# EAGLE design LEDBatterychargeIndicatorCircuit (EAGLE 9.4.2)
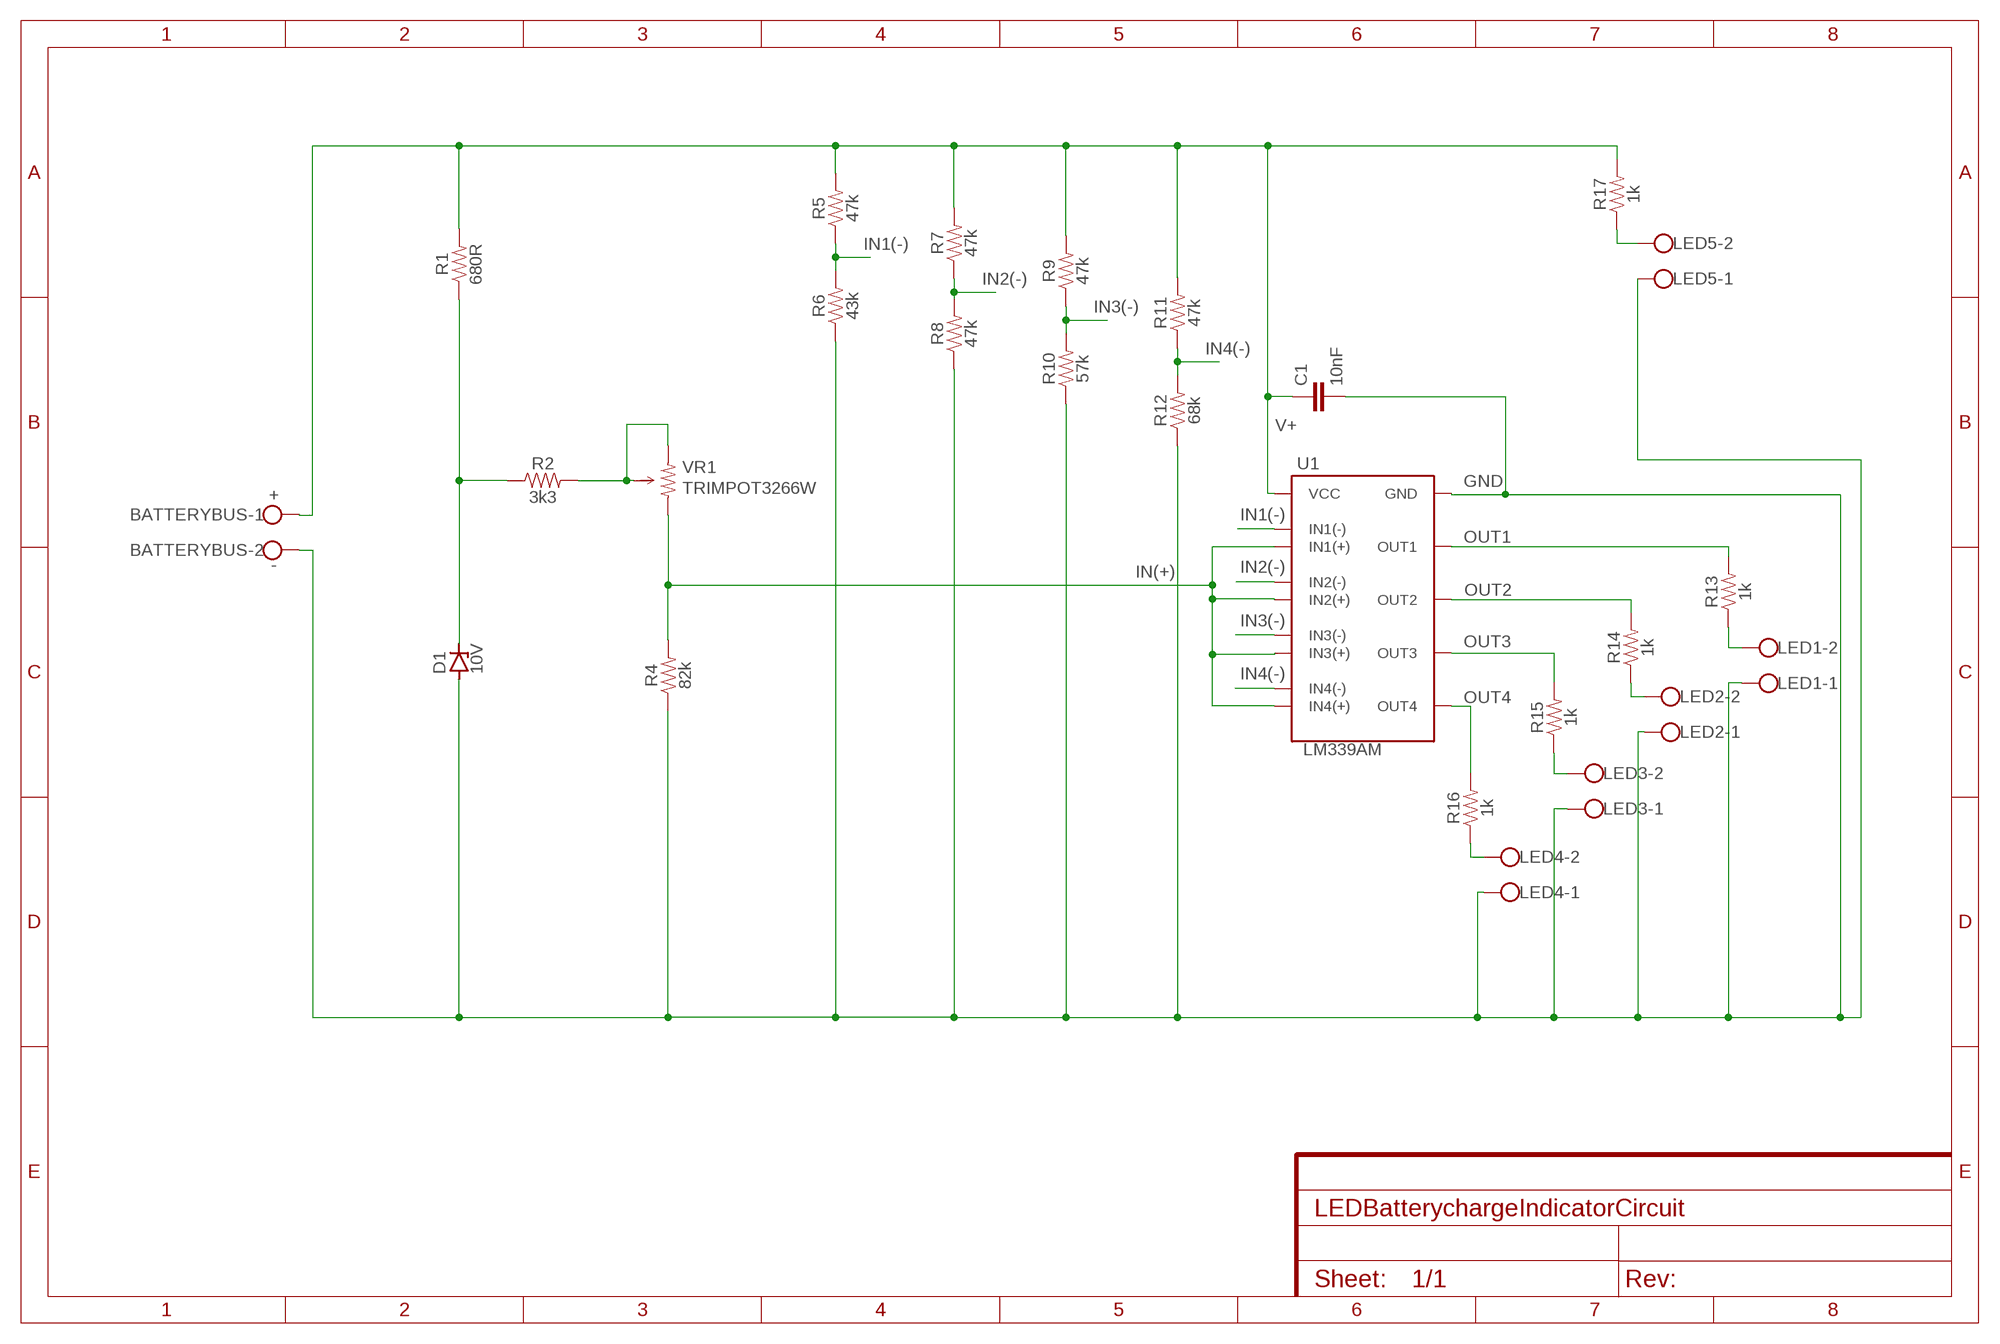
[diagram p0: schematic, sheet 1]

## Parts
BATTERYBUS  W237-102  [W237-102]
C1  10nF  C7.5/5  [C7.5B5]
D1  10V  ZENER-DIODEF126-12  [F126Z12]
LED1  W237-102  [W237-102]
LED2  W237-102  [W237-102]
LED3  W237-102  [W237-102]
LED4  W237-102  [W237-102]
LED5  W237-102  [W237-102]
R1  680R  RESISTOR0805  [0805]
R2  3k3  RESISTOR0805  [0805]
R4  82k  RESISTOR0805  [0805]
R5  47k  RESISTOR0805  [0805]
R6  43k  RESISTOR0805  [0805]
R7  47k  RESISTOR0805  [0805]
R8  47k  RESISTOR0805  [0805]
R9  47k  RESISTOR0805  [0805]
R10  57k  RESISTOR0805  [0805]
R11  47k  RESISTOR0805  [0805]
R12  68k  RESISTOR0805  [0805]
R13  1k  RESISTOR0805  [0805]
R14  1k  RESISTOR0805  [0805]
R15  1k  RESISTOR0805  [0805]
R16  1k  RESISTOR0805  [0805]
R17  1k  RESISTOR0805  [0805]
U1  LM339AM  LM339AMSMD  [LM339AM]
VR1  TRIMPOT3266W  [TRIMPOT3266W]

## Nets
GND: BATTERYBUS.2 C1.2 D1.A LED1.1 LED2.1 LED3.1 LED4.1 LED5.1 R4.1 R6.1 R8.1 R10.1 R12.1 U1.12(GND)
IN1(-): R5.1 R6.2 U1.4(IN1(-))
IN2(-): R7.1 R8.2 U1.6(IN2(-))
IN3(-): R9.1 R10.2 U1.8(IN3(-))
IN4(-): R11.1 R12.2 U1.10(IN4(-))
IN(+): R4.2 U1.5(IN1(+)) U1.7(IN2(+)) U1.9(IN3(+)) U1.11(IN4(+)) VR1.1
N$4: D1.C R1.1 R2.1
N$6: R2.2 VR1.2(WIPER) VR1.3
N$8: LED1.2 R13.1
N$10: LED2.2 R14.1
N$13: LED3.2 R15.1
N$15: LED4.2 R16.1
N$16: LED5.2 R17.1
OUT1: R13.2 U1.2(OUT1)
OUT2: R14.2 U1.1(OUT2)
OUT3: R15.2 U1.14(OUT3)
OUT4: R16.2 U1.13(OUT4)
V+: BATTERYBUS.1 C1.1 R1.2 R5.2 R7.2 R9.2 R11.2 R17.2 U1.3(VCC)

## Notes on the sheet
- +
- -

## Library data of the parts
BATTERYBUS LED1-LED5 = con-wago-500:W237-102: WAGO SCREW CLAMP; MPN: 237-102; OC_FARNELL: unknown; OC_NEWARK: 70K9898
C1 = capacitor-wima:C: CAPACITOR naming: grid - package width
D1 = diode:ZENER-DIODE: Z-Diode
R1 R2 R4-R17 = SparkFun-Resistors:RESISTOR: Generic Resistor Package
U1 = RequiredComponents:LM339AM: The LM339AM is a quad comparator that requires 32V supply (+-18V) with a typical response time of 1.3us
VR1 = RequiredComponents:TRIMPOT3266W

## Board
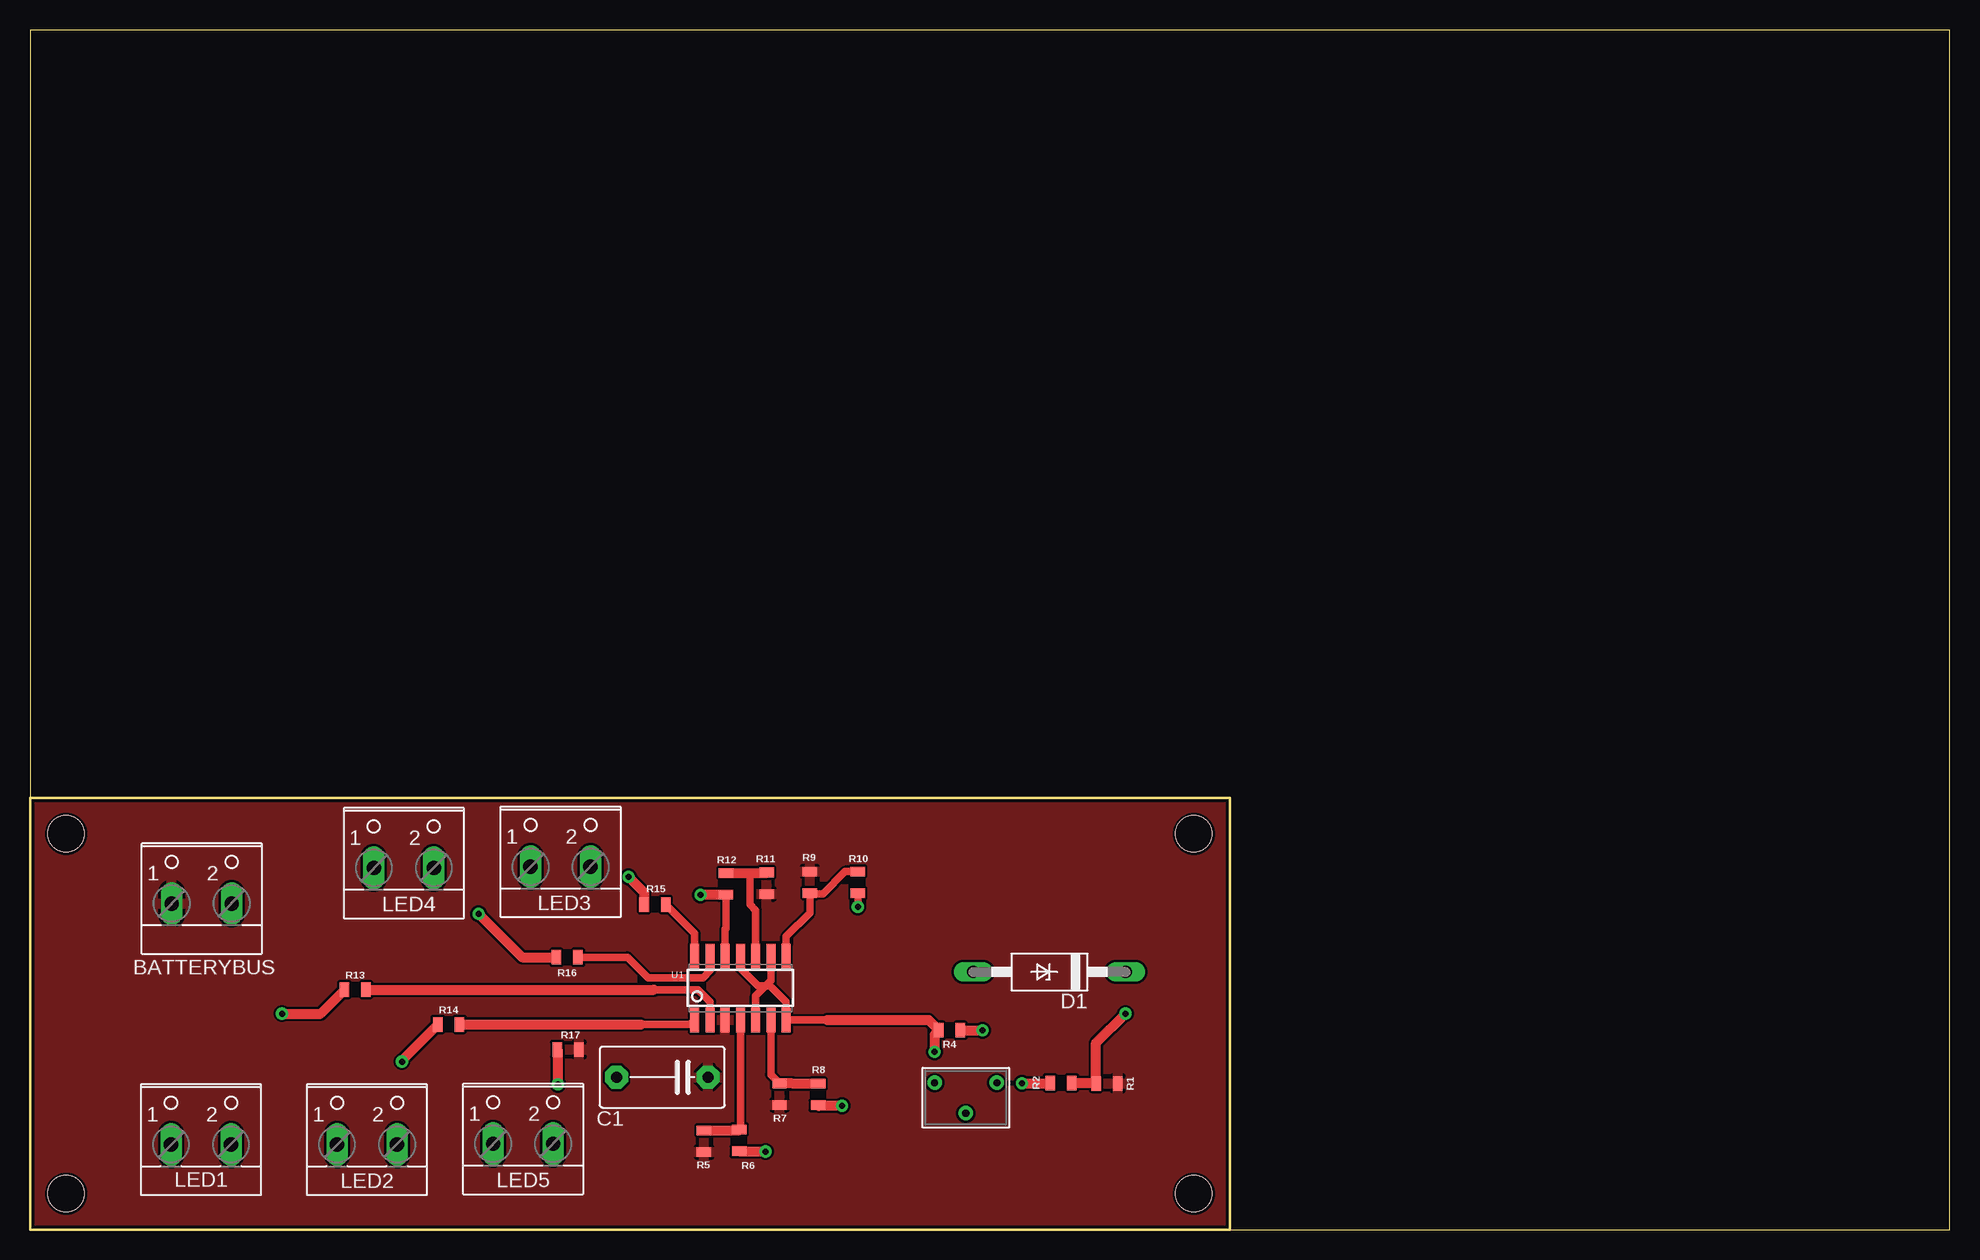
[diagram p1: board, top side]
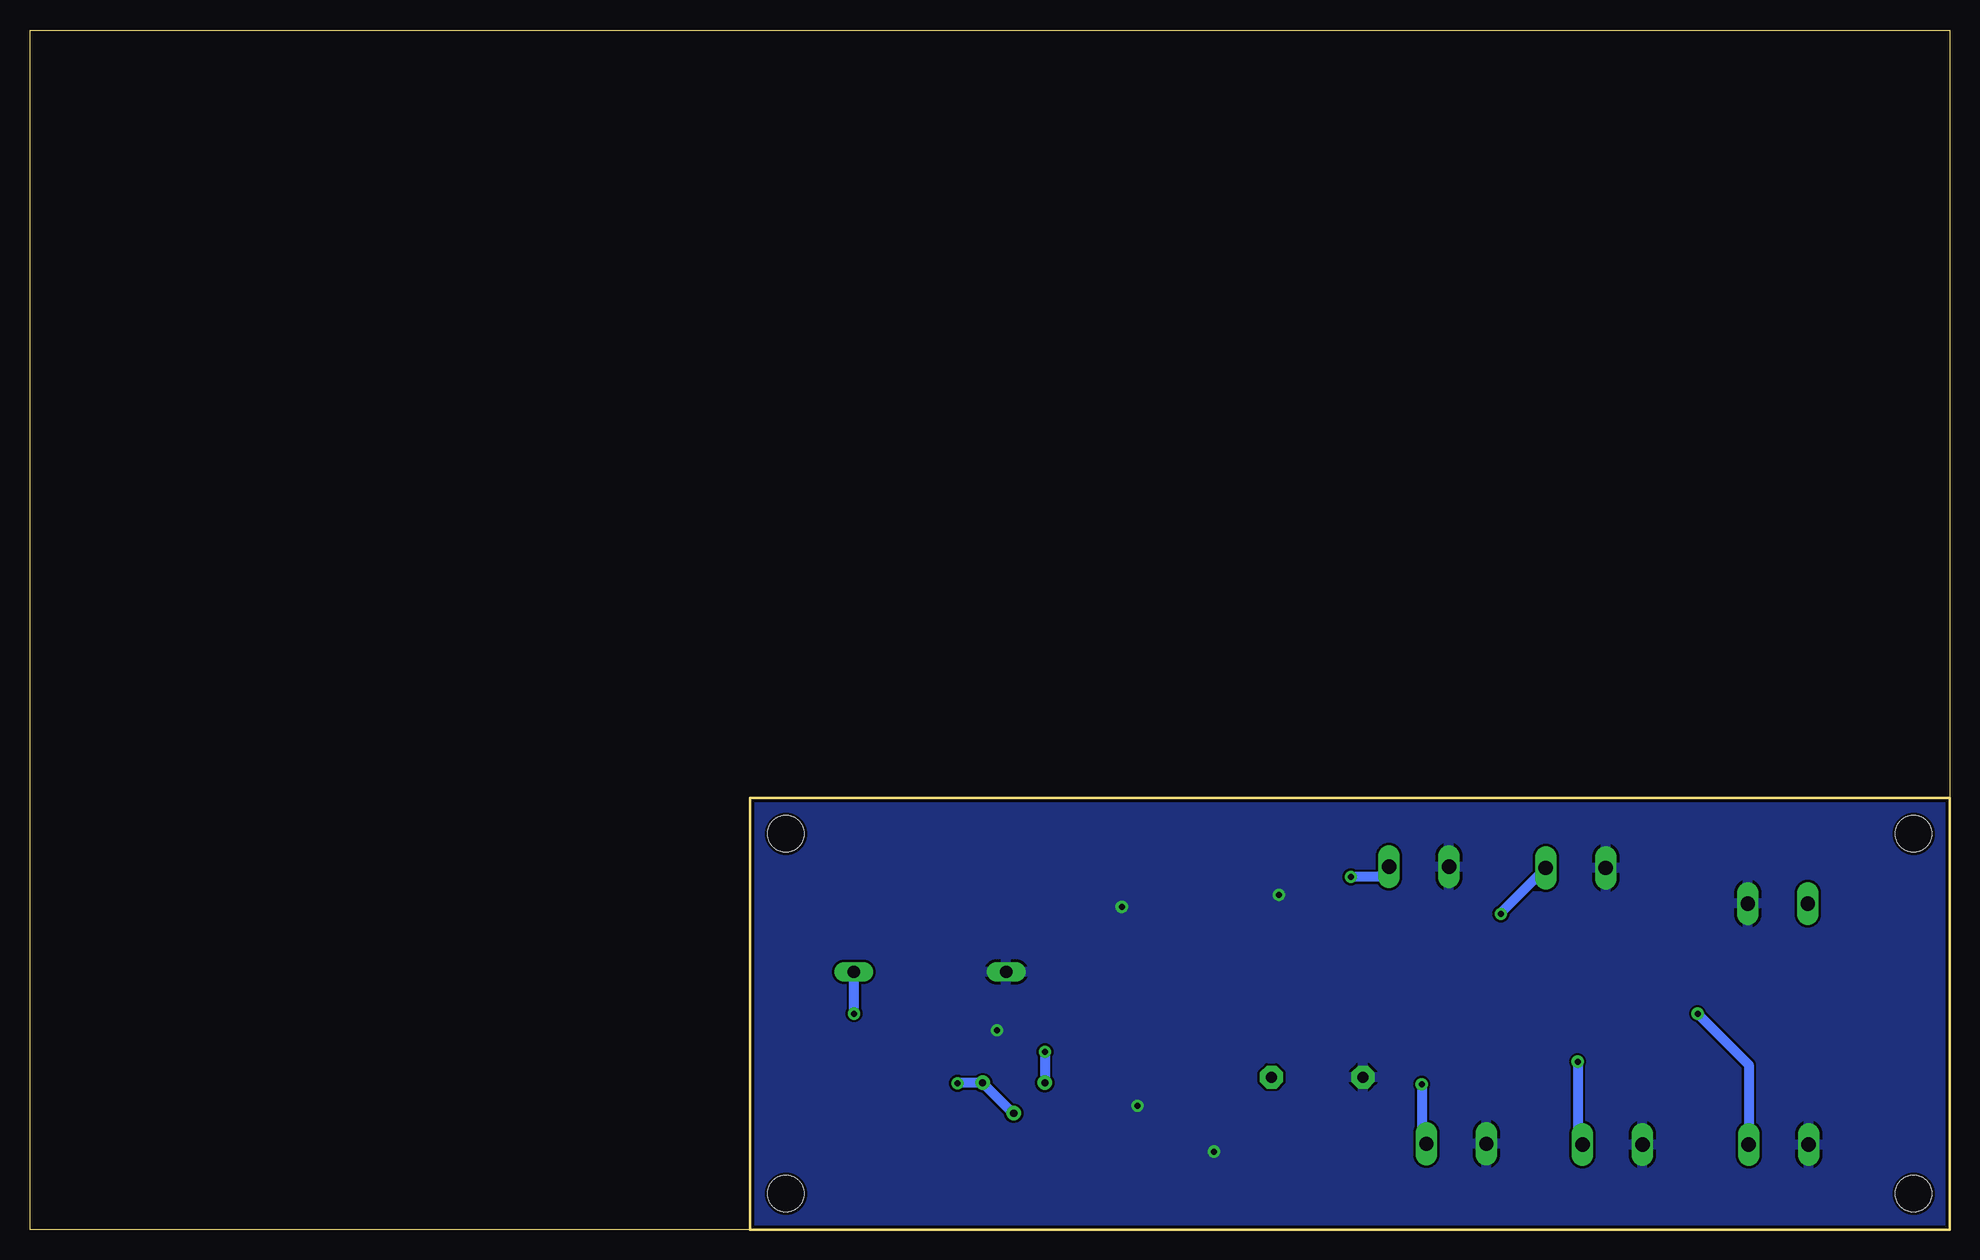
[diagram p2: board, bottom side, seen from below]

Size 160 x 100 mm. Coordinates in mm from the lower left corner, seen from the top.
Outline: 100,0 160,0 160,100 0,100 0,36
Outline: 0,36 0,0 100,0
Outline: 0,36 100,36 100,0
Copper layers (1*16): Top 0.035mm / dielectric 1.5mm / Bottom 0.035mm
Design rules "PCBTrain": minimum track width 8mil, minimum drill 0.2mm, track to track 8mil, track to pad 8mil, pad to pad 8mil, via to via 8mil, smd to smd 8mil, copper to edge 0.25mm, drill to drill 8mil, minimum pad ring 12mil, minimum via ring 10mil, stop-mask expansion 4mil, vias tented up to drill 20mil, thermal gap 10mil
Holes 3 mm at 3,33 3,3 97,3 97,33

### Footprints (pad centres in the part's own frame; a part is rotated, then mirrored left to right if it is on the bottom)
W237-102 = drill 1.194 long: 1 -2.5,-1.27; 2 2.5,-1.27
C7.5B5 = drill 0.914 pad 1.905 octagon: 1 -3.81,0; 2 3.81,0
F126Z12 = drill 1.016 long: A 6.35,0; C -6.35,0
0805 = smd 0.8 x 1.2: 1 -0.9,0; 2 0.9,0
LM339AM = smd 0.75 x 2.04: 1 -3.81,-2.66; 2 -2.54,-2.66; 3 -1.27,-2.66; 4 0,-2.66; 5 1.27,-2.66; 6 2.54,-2.66; 7 3.81,-2.66; 8 3.81,2.66; 9 2.54,2.66; 10 1.27,2.66; 11 0,2.66; 12 -1.27,2.66; 13 -2.54,2.66; 14 -3.81,2.66
TRIMPOT3266W = drill 0.6: 1 -2.595,1.23; 2 0,-1.31; 3 2.595,1.23

### Placement (x,y rotation side)
BATTERYBUS  14.31,28.45 0 top
C1  52.7,12.7 180 top
D1  84.98,21.47 180 top
LED1  14.25,8.35 0 top
LED2  28.09,8.35 0 top
LED3  44.22,31.51 0 top
LED4  31.16,31.41 0 top
LED5  41.1,8.41 0 top
R1  89.77,12.18 0 top
R2  85.94,12.22 180 top
R4  76.65,16.62 180 top
R5  56.18,7.36 270 top
R6  59.12,7.43 90 top
R7  62.48,11.28 270 top
R8  65.7,11.26 90 top
R9  65,28.95 90 top
R10  69,28.94 90 top
R11  61.4,28.87 270 top
R12  58,28.82 90 top
R13  27.11,20 0 top
R14  34.9,17.1 0 top
R15  52.09,27.1 0 top
R16  44.78,22.7 0 top
R17  44.86,15.01 0 top
U1  59.22,20.13 0 top
VR1  78,11 0 top

### Tracks (layer width: path | path; a pad name or v marks a point on that pad's centre or on a via)
GND  (via drill 0.5)
  Top 0.61: U1.12 57.95,25.05 58,25.1 R12.1 | R10.1 v69,26.9
  Top 0.813: v67.7,10.3 65.76,10.3 R8.1 | v61.3,6.5 61.27,6.53 R6.1 | v55.9,27.9 55.92,27.92 R12.1 | R4.1 79.38,16.62 v79.4,16.6
  pour Bottom: 0,36 100,36 100,0 0,0
IN1(-)
  Top 0.61: R6.2 59.22,8.43 U1.4
  Top 0.813: R5.1 59.05,8.26 R6.2
IN2(-)
  Top 0.61: U1.6 61.76,12.9 R7.1
  Top 0.813: R8.2 63.6,12.16 63.58,12.18 R7.1
IN3(-)
  Top 0.61: U1.8 63.03,24.43 65,26.4 R9.1 65.05,28 66.1,28 67.94,29.84 R10.2
IN4(-)
  Top 0.61: U1.10 60.49,26.61 60,27.1 60,29.72
  Top 0.813: R11.1 61.35,29.72 60,29.72 R12.2
IN(+)  (via drill 0.5)
  Top 0.61: U1.5 60.49,19.49 61.3,20.3 | U1.9 61.76,20.76 61.3,20.3 | 66.47,17.47 U1.7 63,17.5 63,19 61.7,20.3 61.3,20.3 | U1.11 59.22,21.78 60.7,20.3 61.3,20.3
  Top 0.813: 66.47,17.47 74.9,17.47 R4.2 75.4,16.27 v75.4,14.8
  Bottom 0.813: v75.4,14.8 VR1.1
N$4  (via drill 0.5)
  Top 0.813: R2.1 88.83,12.22 R1.1 88.87,15.57 v91.3,18
  Bottom 0.813: v91.3,18 91.3,21.44 D1.C
N$6  (via drill 0.5)
  Top 0.813: v82.7,12.2 85.02,12.2 R2.2
  Bottom 0.813: VR1.2 78.06,9.69 VR1.3 82.67,12.23 v82.7,12.2
N$8  (via drill 0.5)
  Top 0.813: R13.1 24.21,18 v21,18
  Bottom 0.813: v21,18 16.75,13.75 LED1.2
N$10  (via drill 0.5)
  Top 0.813: R14.1 31,14.1 v31,14
  Bottom 0.813: v31,14 31,7.49 LED2.2
N$13  (via drill 0.5)
  Top 0.813: v49.9,29.4 51.19,28.11 R15.1
  Bottom 0.813: LED3.2 47.56,29.4 v49.9,29.4
N$15  (via drill 0.5)
  Top 0.813: v37.4,26.3 41,22.7 R16.1
  Bottom 0.813: LED4.2 37.4,26.4 v37.4,26.3
N$16  (via drill 0.5)
  Top 0.813: R17.1 43.96,12.14 v44,12.1
  Bottom 0.813: v44,12.1 44,7.54 LED5.2
OUT1
  Top 0.61: U1.2 56.7,17.49 56.7,19 55.7,20 52,20
  Top 0.813: R13.2 52,20
OUT2
  Top 0.61: 50.9,17.1 55.04,17.1 U1.1
  Top 0.813: R14.2 50.9,17.1
OUT3
  Top 0.61: R15.2 55.41,24.68 U1.14
OUT4
  Top 0.61: R16.2 49.8,22.7 51.5,21 56.1,21 56.7,21.6 56.7,22.77 U1.13
V+
  pour Top: 0,36 100,36 100,0 0,0